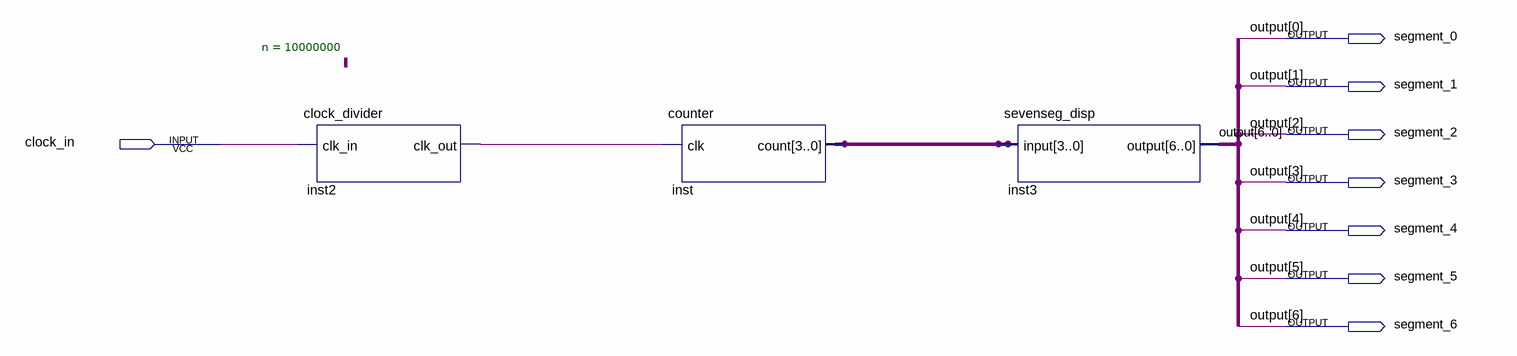
[diagram p0: schematic sheet]
// Quartus schematic Block_diagram.bdf as structural Verilog: 3 symbols, 8 pins
module Block_diagram (
  input  clock_in,
  output segment_0,
  output segment_1,
  output segment_2,
  output segment_3,
  output segment_4,
  output segment_5,
  output segment_6
);

  wire inst2_clk_out;
  wire [3:0] inst_count;

  clock_divider #(.n(10000000)) inst2 (.clk_in(clock_in), .clk_out(inst2_clk_out));
  counter inst (.clk(inst2_clk_out), .count(inst_count));
  sevenseg_disp inst3 (
    .\input (inst_count),
    .\output ({segment_6, segment_5, segment_4, segment_3, segment_2, segment_1, segment_0}));

  // Other names for the same wires on the sheet: output[6:0] = {segment_6, segment_5, segment_4, segment_3, segment_2, segment_1, segment_0}
endmodule
